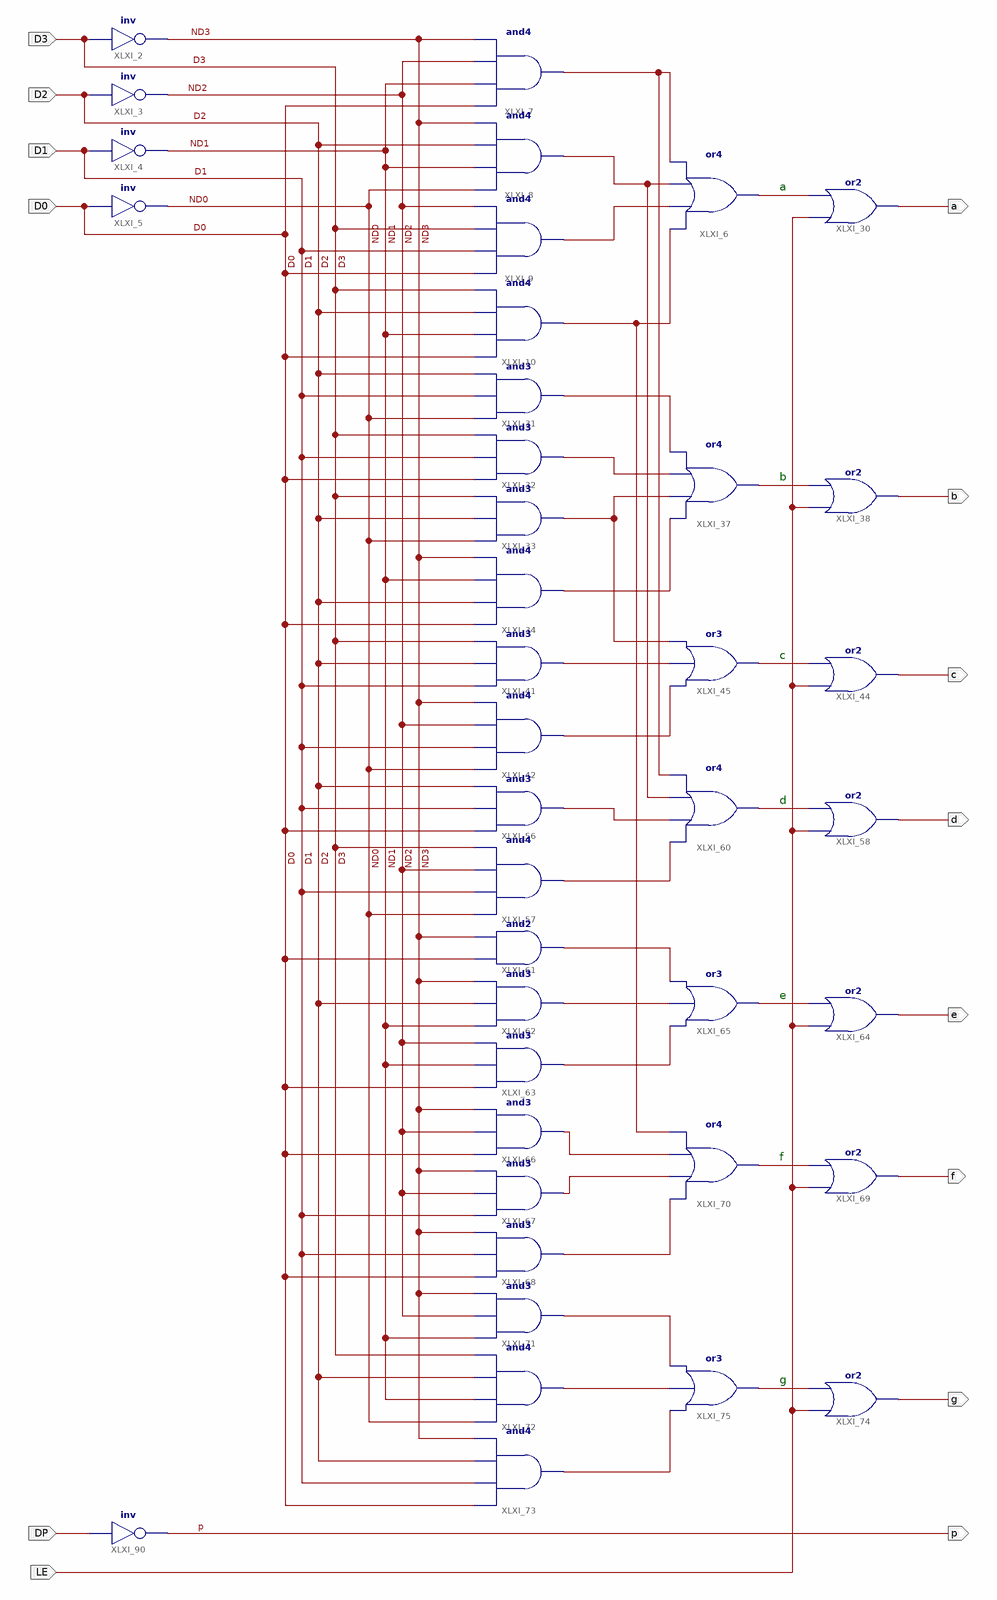
[diagram p0: schematic sheet 1]
// Xilinx ISE schematic MyMC14495.sch (kintex7) as structural Verilog: 40 symbols, 14 ports
module MyMC14495 (
  input  D1,
  input  D3,
  input  D2,
  input  D0,
  input  LE,
  input  DP,
  output a,
  output c,
  output e,
  output g,
  output b,
  output d,
  output f,
  output p
);

  wire ND0, ND1, ND2, ND3, XLXN_32, XLXN_33, XLXN_42, XLXN_52, XLXN_53, XLXN_54, XLXN_55, XLXN_56, XLXN_58,
       XLXN_71, XLXN_72, XLXN_75, XLXN_78, XLXN_79, XLXN_80, XLXN_83, XLXN_84, XLXN_85, XLXN_86, XLXN_88,
       XLXN_89, XLXN_90, XLXN_91, XLXN_92, XLXN_94, XLXN_95, XLXN_96, XLXN_97;

  not XLXI_4 (ND1, D1);
  not XLXI_5 (ND0, D0);
  not XLXI_3 (ND2, D2);
  not XLXI_2 (ND3, D3);
  and XLXI_7 (XLXN_80, D0, ND1, ND2, ND3);
  and XLXI_8 (XLXN_32, ND0, ND1, D2, ND3);
  and XLXI_9 (XLXN_33, D0, D1, D3, ND2);
  and XLXI_31 (XLXN_53, ND0, D1, D2);
  and XLXI_32 (XLXN_54, D0, D1, D3);
  and XLXI_33 (XLXN_55, ND0, D2, D3);
  and XLXI_34 (XLXN_56, D0, D2, ND1, ND3);
  or XLXI_30 (a, LE, XLXN_42);
  or XLXI_6 (XLXN_42, XLXN_92, XLXN_33, XLXN_32, XLXN_80);
  and XLXI_10 (XLXN_92, D0, ND1, D2, D3);
  and XLXI_41 (XLXN_71, D1, D2, D3);
  and XLXI_42 (XLXN_72, ND0, D1, ND2, ND3);
  or XLXI_44 (c, LE, XLXN_58);
  or XLXI_45 (XLXN_58, XLXN_72, XLXN_71, XLXN_55);
  and XLXI_56 (XLXN_78, D0, D1, D2);
  and XLXI_57 (XLXN_79, ND0, D1, ND2, D3);
  and XLXI_61 (XLXN_85, D0, ND3);
  and XLXI_62 (XLXN_84, ND1, D2, ND3);
  and XLXI_63 (XLXN_86, D0, ND1, ND2);
  or XLXI_64 (e, LE, XLXN_83);
  or XLXI_65 (XLXN_83, XLXN_86, XLXN_84, XLXN_85);
  and XLXI_66 (XLXN_89, D0, ND2, ND3);
  and XLXI_67 (XLXN_90, D1, ND2, ND3);
  and XLXI_68 (XLXN_91, D0, D1, ND3);
  and XLXI_71 (XLXN_95, ND1, ND2, ND3);
  and XLXI_72 (XLXN_96, ND0, ND1, D2, D3);
  and XLXI_73 (XLXN_97, D0, D1, D2, ND3);
  or XLXI_74 (g, LE, XLXN_94);
  or XLXI_75 (XLXN_94, XLXN_97, XLXN_96, XLXN_95);
  or XLXI_38 (b, LE, XLXN_52);
  or XLXI_37 (XLXN_52, XLXN_56, XLXN_55, XLXN_54, XLXN_53);
  or XLXI_60 (XLXN_75, XLXN_79, XLXN_78, XLXN_32, XLXN_80);
  or XLXI_58 (d, LE, XLXN_75);
  or XLXI_69 (f, LE, XLXN_88);
  or XLXI_70 (XLXN_88, XLXN_91, XLXN_90, XLXN_89, XLXN_92);
  not XLXI_90 (p, DP);

  // Notes on the sheet:
  //   a
  //   b
  //   c
  //   d
  //   e
  //   f
  //   g
endmodule
